# EAGLE schematic mPCIe (EAGLE 7.3.0)
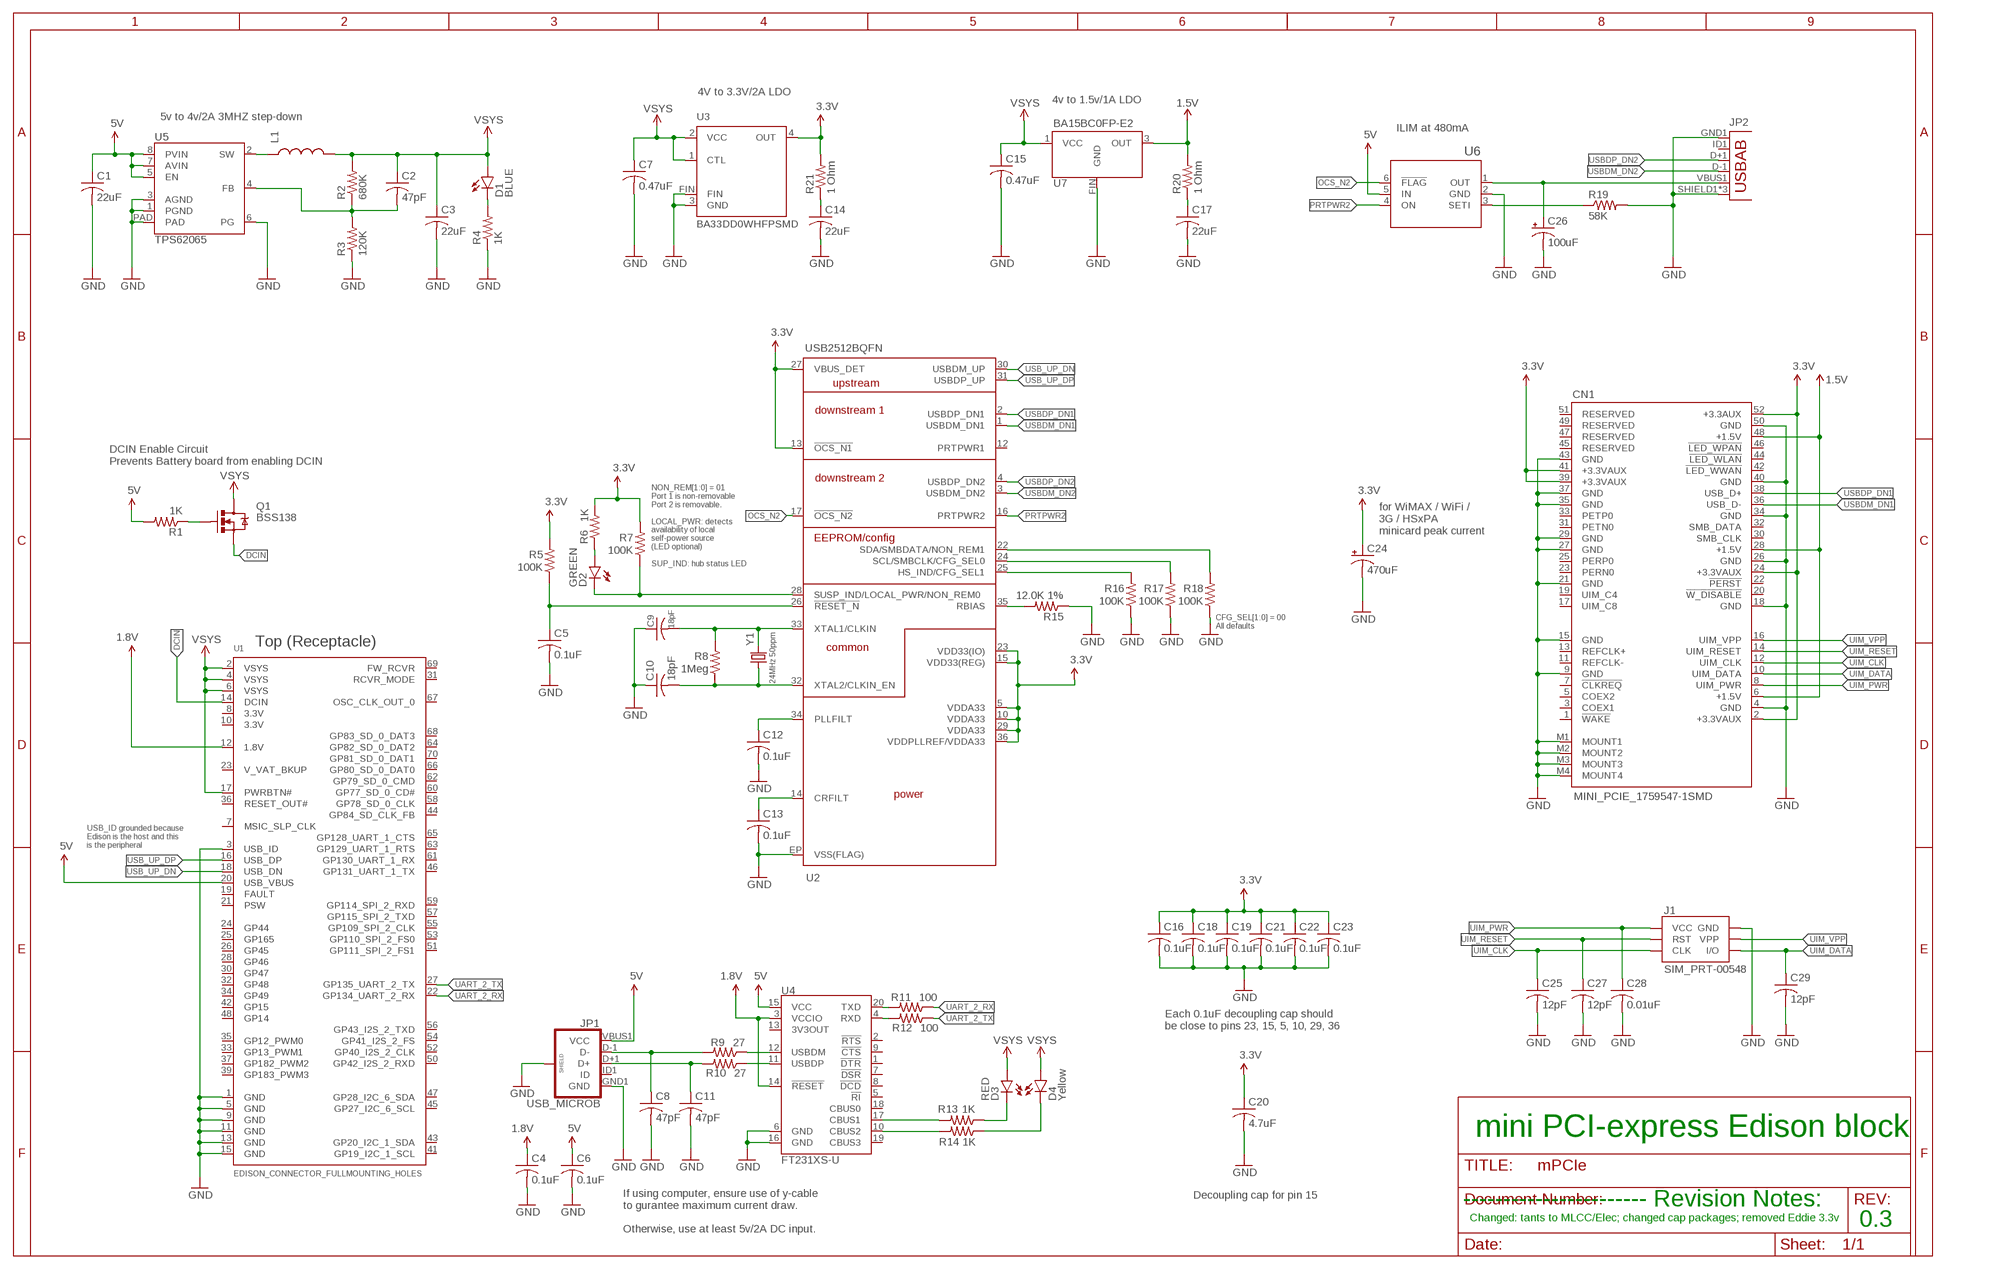
[diagram p0: schematic, sheet 1]

## Parts
C1  22uF  C-USC0603K  [C0603K]
C2  47pF  C-USC0402K  [C0402K]
C3  22uF  C-USC0603K  [C0603K]
C4  0.1uF  C-USC0402K  [C0402K]
C5  0.1uF  C-USC0402K  [C0402K]
C6  0.1uF  C-USC0402K  [C0402K]
C7  0.47uF  C-USC0402K  [C0402K]
C8  47pF  C-USC0402K  [C0402K]
C9  18pF  C-USC0402K  [C0402K]
C10  18pF  C-USC0402K  [C0402K]
C11  47pF  C-USC0402K  [C0402K]
C12  0.1uF  C-USC0402K  [C0402K]
C13  0.1uF  C-USC0402K  [C0402K]
C14  22uF  C-USC0603K  [C0603K]
C15  0.47uF  C-USC0402K  [C0402K]
C16  0.1uF  C-USC0402K  [C0402K]
C17  22uF  C-USC0603K  [C0603K]
C18  0.1uF  C-USC0402K  [C0402K]
C19  0.1uF  C-USC0402K  [C0402K]
C20  4.7uF  C-USC0603K  [C0603K]
C21  0.1uF  C-USC0402K  [C0402K]
C22  0.1uF  C-USC0402K  [C0402K]
C23  0.1uF  C-USC0402K  [C0402K]
C24  470uF  CAP_POLE  [PANASONIC_E]
C25  12pF  C-USC0402K  [C0402K]
C26  100uF  CAP_POLE  [PANASONIC_E]
C27  12pF  C-USC0402K  [C0402K]
C28  0.01uF  C-USC0402K  [C0402K]
C29  12pF  C-USC0402K  [C0402K]
CN1  MINI_PCIE_1759547-1SMD  [MINI_PCIE_1759547-1]
D1  BLUE  LED-BLUE0603  [LED-0603]
D2  GREEN  LED-GREEN0603  [LED-0603]
D3  RED  LED-RED0603  [LED-0603]
D4  Yellow  LED-YELLOW0603  [LED-0603]
J1  SIM_PRT-00548  SIMHOLDERSIM  [SIMHOLDER]
JP1  USB_MICROB  USB_MICROB_PLUGCONN-11752  [USB-B-MICRO-SMD_V03]
JP2  USB-ABCONN-11794  [USB-AB-MICRO-SMD_V03]
L1  INDUCTOR  [INDUCTOR-SRP4020]
Q1  BSS138  MOSFET-NCHANNELBSS138  [SOT23-3]
R1  1K  R-US_R0402  [R0402]
R2  680K  R-US_R0402  [R0402]
R3  120K  R-US_R0402  [R0402]
R4  1K  R-US_R0402  [R0402]
R5  100K  R-US_R0402  [R0402]
R6  1K  R-US_R0402  [R0402]
R7  100K  R-US_R0402  [R0402]
R8  1Meg  R-US_R0402  [R0402]
R9  27  R-US_R0402  [R0402]
R10  27  R-US_R0402  [R0402]
R11  100  R-US_R0402  [R0402]
R12  100  R-US_R0402  [R0402]
R13  1K  R-US_R0402  [R0402]
R14  1K  R-US_R0402  [R0402]
R15  12.0K 1%  R-US_R0402  [R0402]
R16  100K  R-US_R0402  [R0402]
R17  100K  R-US_R0402  [R0402]
R18  100K  R-US_R0402  [R0402]
R19  58K  R-US_R0402  [R0402]
R20  1 Ohm  R-US_R0402  [R0402]
R21  1 Ohm  R-US_R0402  [R0402]
U1  EDISON_CONNECTOR_FULLMOUNTING_HOLES  [EDISON_DAUGHTER]
U2  USB2512BQFN  [QFN-36]
U3  BA33DD0WHFPSMD  [HRP5]
U4  FT231XS-U  FT231XS  [SSOP20_L]
U5  TPS62065  [WSON-8-PAD]
U6  MAX4995AAUT+  [21-0058I]
U7  BA15BC0FP-E2  [TO252-3]
Y1  24MHz 50ppm  CRYSTAL5X3  [CRYSTAL-SMD-5X3]

## Nets
1.5V: CN1.6(+1.5V) CN1.28(+1.5V) CN1.48(+1.5V)
1.8V: C4.1 U1.12(1.8V) U4.3(VCCIO) U4.14(!RESET)
3.3V: C16.1 C18.1 C19.1 C20.1 C21.1 C22.1 C23.1 C24.+ CN1.2(+3.3VAUX) CN1.24(+3.3VAUX) CN1.39(+3.3VAUX) CN1.41(+3.3VAUX) CN1.52(+3.3AUX) R5.2 R6.2 R7.2 R21.2 U2.5(VDDA33) U2.10(VDDA33) U2.13(!OCS_N1) U2.15(VDD33(REG)) U2.23(VDD33(IO)) U2.27(VBUS_DET) U2.29(VDDA33) U2.36(VDDPLLREF/VDDA33) U3.4(OUT)
5V: C1.1 C6.1 JP1.VBUS1(VCC) R1.2 U1.20(USB_VBUS) U4.15(VCC) U5.5(EN) U5.7(AVIN) U5.8(PVIN) U6.5(IN)
DCIN: Q1.2(S) U1.14(DCIN)
GND: C1.2 C3.2 C4.2 C5.2 C6.2 C7.2 C8.2 C9.1 C10.1 C11.2 C12.2 C13.2 C14.2 C15.2 C16.2 C17.2 C18.2 C19.2 C20.2 C21.2 C22.2 C23.2 C24.- C25.2 C26.- C27.2 C28.2 C29.2 CN1.4(GND) CN1.9(GND) CN1.15(GND) CN1.18(GND) CN1.21(GND) CN1.26(GND) CN1.27(GND) CN1.29(GND) CN1.34(GND) CN1.35(GND) CN1.37(GND) CN1.40(GND) CN1.43(GND) CN1.50(GND) CN1.M1(MOUNT1) CN1.M2(MOUNT2) CN1.M3(MOUNT3) CN1.M4(MOUNT4) J1.C5(GND) JP1.GND1(GND) JP1.SHIELD1(SHIELD) JP1.SHIELD2(SHIELD) JP1.SHIELD3(SHIELD) JP2.GND1(GND) JP2.SHIELD1(SHIELD) JP2.SHIELD2(SHIELD) JP2.SHIELD3(SHIELD) R3.1 R4.1 R15.1 R16.1 R17.1 R18.1 R19.2 U1.1(GND) U1.3(USB_ID) U1.5(GND) U1.9(GND) U1.11(GND) U1.13(GND) U1.15(GND) U2.EP(VSS(FLAG)) U3.3(GND) U3.FIN U4.6(GND) U4.16(GND) U5.1(PGND) U5.3(AGND) U5.6(PG) U5.PAD U6.2(GND) U7.FIN(GND)
N$1: C13.1 U2.14(CRFILT)
N$2: C9.2 R8.2 U2.33(XTAL1/CLKIN) Y1.3
N$3: C12.1 U2.34(PLLFILT)
N$4: C10.2 R8.1 U2.32(XTAL2/CLKIN_EN) Y1.1
N$5: R15.2 U2.35(RBIAS)
N$6: C5.1 R5.1 U2.26(!RESET_N)
N$7: D2.C R7.1 U2.28(SUSP_IND/LOCAL_PWR/NON_REM0)
N$8: R18.2 U2.22(SDA/SMBDATA/NON_REM1)
N$9: C26.+ JP2.VBUS1(VBUS) U6.1(OUT)
N$10: R16.2 U2.25(HS_IND/CFG_SEL1)
N$11: R9.1 U4.12(USBDM)
N$12: R17.2 U2.24(SCL/SMBCLK/CFG_SEL0)
N$13: R10.1 U4.11(USBDP)
N$14: C8.1 JP1.D-1(D-) R9.2
N$15: C11.1 JP1.D+1(D+) R10.2
N$16: C17.1 R20.1
N$17: R11.2 U4.20(TXD)
N$18: R12.2 U4.4(RXD)
N$19: R14.2 U4.10(CBUS2)
N$20: R13.2 U4.17(CBUS1)
N$21: C14.1 R21.1
N$22: D3.C R13.1
N$23: D4.C R14.1
N$24: Q1.1(G) R1.1
N$25: L1.P$1 U5.2(SW)
N$26: C2.2 R2.1 R3.2 U5.4(FB)
N$27: R19.1 U6.3(SETI)
N$28: D2.A R6.1
N$29: D1.C R4.2
OCS_N2: U2.17(!OCS_N2) U6.6(!FLAG)
P$1: R20.2 U7.3(OUT) ; supply symbol labelled 1.5V
PRTPWR2: U2.16(PRTPWR2) U6.4(ON)
UART_2_RX: R11.1 U1.22(GP134_UART_2_RX)
UART_2_TX: R12.1 U1.27(GP135_UART_2_TX)
UIM_CLK: C25.1 CN1.12(UIM_CLK) J1.C3(CLK)
UIM_DATA: C29.1 CN1.10(UIM_DATA) J1.C7(I/O)
UIM_PWR: C28.1 CN1.8(UIM_PWR) J1.C1(VCC)
UIM_RESET: C27.1 CN1.14(UIM_RESET) J1.C2(RST)
UIM_VPP: CN1.16(UIM_VPP) J1.C6(VPP)
USB_UP_DN: U1.18(USB_DN) U2.30(USBDM_UP)
USB_UP_DP: U1.16(USB_DP) U2.31(USBDP_UP)
USBDM_DN1: CN1.36(USB_D-) U2.1(USBDM_DN1)
USBDM_DN2: JP2.D-1(D-) U2.3(USBDM_DN2)
USBDP_DN1: CN1.38(USB_D+) U2.2(USBDP_DN1)
USBDP_DN2: JP2.D+1(D+) U2.4(USBDP_DN2)
VSYS: C2.1 C3.1 C7.1 C15.1 D1.A D3.A D4.A L1.P$2 Q1.3(D) R2.2 U1.2(VSYS) U1.4(VSYS) U1.6(VSYS) U1.17(PWRBTN#) U3.1(CTL) U3.2(VCC) U7.1(VCC)
Unconnected: CN1.1(!WAKE) CN1.3(COEX1) CN1.5(COEX2) CN1.7(!CLKREQ) CN1.11(REFCLK-) CN1.13(REFCLK+) CN1.17(UIM_C8) CN1.19(UIM_C4) CN1.20(!W_DISABLE) CN1.22(!PERST) CN1.23(PERN0) CN1.25(PERP0) CN1.30(SMB_CLK) CN1.31(PETN0) CN1.32(SMB_DATA) CN1.33(PETP0) CN1.42(!LED_WWAN) CN1.44(!LED_WLAN) CN1.45(RESERVED) CN1.46(!LED_WPAN) CN1.47(RESERVED) CN1.49(RESERVED) CN1.51(RESERVED) JP1.ID1(ID) JP2.ID1(USBID) U1.7(MSIC_SLP_CLK) U1.8(3.3V) U1.10(3.3V) U1.19(FAULT) U1.21(PSW) U1.23(V_VAT_BKUP) U1.24(GP44) U1.25(GP165) U1.26(GP45) U1.28(GP46) U1.30(GP47) U1.31(RCVR_MODE) U1.32(GP48) U1.33(GP13_PWM1) U1.34(GP49) U1.35(GP12_PWM0) U1.36(RESET_OUT#) U1.37(GP182_PWM2) U1.39(GP183_PWM3) U1.41(GP19_I2C_1_SCL) U1.42(GP15) U1.43(GP20_I2C_1_SDA) U1.44(GP84_SD_CLK_FB) U1.45(GP27_I2C_6_SCL) U1.46(GP131_UART_1_TX) U1.47(GP28_I2C_6_SDA) U1.48(GP14) U1.50(GP42_I2S_2_RXD) U1.51(GP111_SPI_2_FS1) U1.52(GP40_I2S_2_CLK) U1.53(GP110_SPI_2_FS0) U1.54(GP41_I2S_2_FS) U1.55(GP109_SPI_2_CLK) U1.56(GP43_I2S_2_TXD) U1.57(GP115_SPI_2_TXD) U1.58(GP78_SD_0_CLK) U1.59(GP114_SPI_2_RXD) U1.60(GP77_SD_0_CD#) U1.61(GP130_UART_1_RX) U1.62(GP79_SD_0_CMD) U1.63(GP129_UART_1_RTS) U1.64(GP82_SD_0_DAT2) U1.65(GP128_UART_1_CTS) U1.66(GP80_SD_0_DAT0) U1.67(OSC_CLK_OUT_0) U1.68(GP83_SD_0_DAT3) U1.69(FW_RCVR) U1.70(GP81_SD_0_DAT1) U2.12(PRTPWR1) U4.1(!DTR) U4.2(!RTS) U4.5(!RI) U4.7(!DSR) U4.8(!DCD) U4.9(!CTS) U4.13(3V3OUT) U4.18(CBUS0) U4.19(CBUS3)

## Notes on the sheet
- 4V to 3.3V/2A LDO
- 4v to 1.5v/1A LDO
- 5v to 4v/2A 3MHZ step-down
- JP2
- ILIM at 480mA
- DCIN Enable Circuit
  Prevents Battery board from enabling DCIN
- for WiMAX / WiFi / 
  3G / HSxPA 
  minicard peak current
- NON_REM[1:0] = 01
  Port 1 is non-removable
  Port 2 is removable.
  
  LOCAL_PWR: detects 
  availability of local 
  self-power source 
  (LED optional)
  
  SUP_IND: hub status LED
- CFG_SEL[1:0] = 00
  All defaults
- Top (Receptacle)
- USB_ID grounded because
  Edison is the host and this
  is the peripheral
- Each 0.1uF decoupling cap should 
  be close to pins 23, 15, 5, 10, 29, 36
- mini PCI-express Edison block
- Decoupling cap for pin 15
- ----------------------- Revision Notes:
- Changed: tants to MLCC/Elec; changed cap packages; removed Eddie 3.3v
- 0.3
- If using computer, ensure use of y-cable
  to gurantee maximum current draw.
  
  Otherwise, use at least 5v/2A DC input.

## Library data of the parts
C1-C23 C25 C27-C29 = rcl:C-US: CAPACITOR, American symbol
C24 C26 = SparkFun-Capacitors:CAP_POL: Capacitor Polarized These are standard SMD and PTH capacitors. Normally 10uF, 47uF, and 100uF in electrolytic and tantalum varieties. Always verify the external diameter of the through hole cap, it varies with capacity, voltage, and manufacturer. The EIA devices should be standard.
CN1 = SparkFun-Connectors:MINI_PCIE_1759547-1: Mini PCI-express connector Based on TE Connectivity's mSATA/mini PCI-E 7H G/F See: http://www.te.com/usa-en/product-1759547-1.html
D1 = SparkFun-LED:LED-BLUE: Blue LEDs for production use Various blue LEDs stocked by SparkFun production 0603 - DIO-08575 Rebel - DIO-09553 1206 - DIO-09911; PROD_ID: DIO-08575
D2 = SparkFun-LED:LED-GREEN: Various green LEDs Green LEDs used in SFE Production 0603- DIO-00821 LARGE- DIO-00862 LILYPAD- DIO-09910; PROD_ID: DIO-00821
D3 = SparkFun-LED:LED-RED: Assorted Red LEDs LilyPad 1206- DIO-09912 1206- DIO-00809 0603- DIO-00819 "SMART" means more efficient and expensive; PROD_ID: DIO-00819
D4 = SparkFun-LED:LED-YELLOW: Yellow SMD LEDs LilyPad 1206- DIO-09909 0603- DIO-09003 "SMART" means more efficient and expensive; PROD_ID: DIO-09003
J1 = SparkFun-Connectors:SIMHOLDER: SIM Socket Socket for SIM cellular cards. Schematic element and footprint production proven. Spark Fun Electronics SKU : PRT-00548; PROD_ID: CONN-08536
JP1 = SparkFun-Connectors:USB_MICROB_PLUG: USB Micro-B connectors Some male, some female. Watch your step!; PROD_ID: CONN-11752
JP2 = SparkFun-Connectors:USB-AB: This is a USB AB connector that is compatible with USB OTG. i.e. this connector can serve as a host or device; PROD_ID: CONN-11794
L1 = SparkFun-Passives:INDUCTOR: Inductors Basic Inductor/Choke - 0603 and 1206. Footprints are not proven and vary greatly between part numbers. INDUCTOR POWER 3.3UH 4.0A SMD 0.197" L x 0.197" W x 0.177" H (5.00mm x 5.00mm x 4.50mm)
Q1 = SparkFun-DiscreteSemi:MOSFET-NCHANNEL: Common NMOSFET Parts MFG P/N Store ID Prod ID FDD8780 TRANS-09984 SI7820DN TRANS-11055 FDS6630A IC-08089 2N7002PW TRANS-11151 FQP30N06L COM-10213 TRANS-10060 BSS123LT1G TRANS-08345 BSS138 TRANS-00830 BS170 2N7000; PROD_ID: TRANS-00830; VALUE: 200mA/50V
R1-R21 = rcl:R-US_: RESISTOR, American symbol
U1 = Edison:EDISON_CONNECTOR_FULL
U2 = SparkFun-DigitalIC:USB2512B: The USB2512B is a 2-Port High Speed USB Hub Controller. It is used on the mPCIe Edison block.
U3 = SparkFun-PowerIC:BA33DD0WHFP: BA33DD0WHFP LDO, 3.3v Output @ 2A, 450mV dropout voltage, 3v to 25v input See http://www.farnell.com/datasheets/1747235.pdf
U4 = SparkFun-DigitalIC:FT231X: FTDI FT231X Full Speed USB to Full-handshake UART This USB2.0 Full Speed IC offers a compact bridge to full handshake UART interfaces. The device is a UART, capable of operating up to 3MBaud, with low power consumption (8mA). The FT231X includes the complete FT-X series feature set and enables USB to be added into a system design quickly and easily over a UART interface.; PROD_ID: IC-11524; VALUE: FTS31XS-U
U5 = SparkFun-PowerIC:TPS62065: TPS62065 DC/DC step-Down regulator.; PROD_ID: IC-12273
U6 = MAX4995:MAX4995AAUT+: Programmable current-limit switch; MANUFACTURER_PART_NUMBER: max4995aaut+; VENDOR: MAXIM
U7 = SparkFun-PowerIC:BA15BC0FP-E2: ROHM BA15BC0FP-E2 1A Fixed 1.5v LDO Vcc(max) = 16v See: http://www.mouser.com/ds/2/348/baxxbc0fp-e-209385.pdf
Y1 = SparkFun-FreqCtrl:CRYSTAL: Various standard crystals. Proven footprints.; PROD_ID: XTAL-08218